# EAGLE design working (EAGLE 6.5.0)
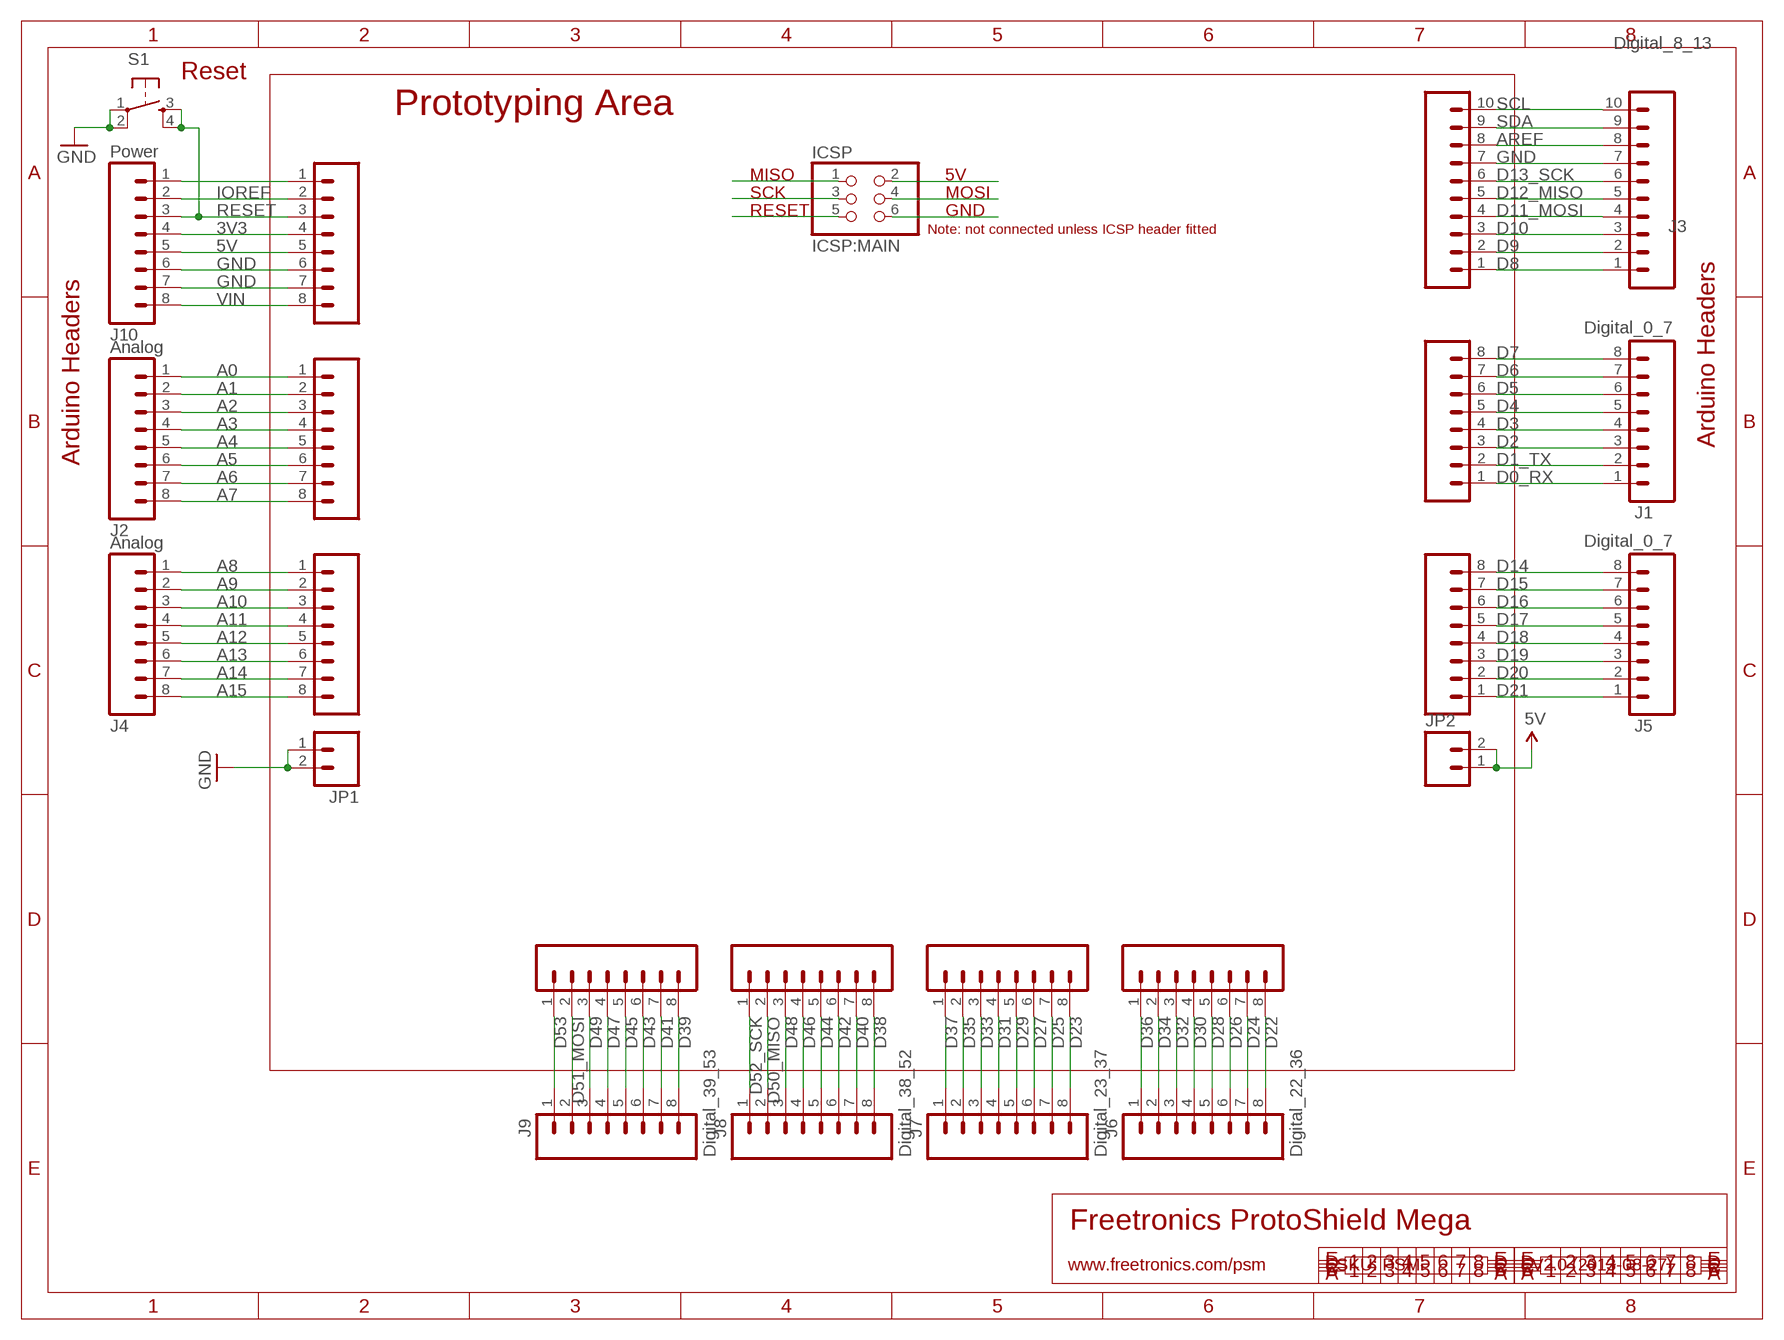
[diagram p0: schematic, sheet 1]

## Parts
ICSP  ICSP:MAIN  PINHD-2X3  [2X03]
J1  Digital_0_7  M08  [1X08]
J2  Analog  M08  [1X08]
J3  Digital_8_13  M100.1  [1X10]
J4  Analog  M08  [1X08]
J5  Digital_0_7  M08  [1X08]
J6  Digital_22_36  M08  [1X08]
J7  Digital_23_37  M08  [1X08]
J8  Digital_38_52  M08  [1X08]
J9  Digital_39_53  M08  [1X08]
J10  Power  M08  [1X08]
JP1  M02PTH  [1X02]
JP2  M02PTH  [1X02]
S1  TAC_SWITCHPTH  [TACTILE-PTH]
SL1  Digital_0_7  M08  [1X08]
SL2  Analog  M08  [1X08]
SL3  Digital_8_13  M100.1  [1X10]
SL4  Analog  M08  [1X08]
SL5  Digital_0_7  M08  [1X08]
SL6  Digital_0_7  M08  [1X08]
SL7  Digital_0_7  M08  [1X08]
SL8  Digital_0_7  M08  [1X08]
SL9  Digital_0_7  M08  [1X08]
SLP  Power  M08  [1X08]

## Nets
3V3: J10.4 SLP.4
5V: J10.5 JP2.1 JP2.2 SLP.5
A0: J2.1 SL2.1
A1: J2.2 SL2.2
A2: J2.3 SL2.3
A3: J2.4 SL2.4
A4: J2.5 SL2.5
A5: J2.6 SL2.6
A6: J2.7 SL2.7
A7: J2.8 SL2.8
A8: J4.1 SL4.1
A9: J4.2 SL4.2
A10: J4.3 SL4.3
A11: J4.4 SL4.4
A12: J4.5 SL4.5
A13: J4.6 SL4.6
A14: J4.7 SL4.7
A15: J4.8 SL4.8
AREF: J3.8 SL3.8
D0_RX: J1.1 SL1.1
D1_TX: J1.2 SL1.2
D2: J1.3 SL1.3
D3: J1.4 SL1.4
D4: J1.5 SL1.5
D5: J1.6 SL1.6
D6: J1.7 SL1.7
D7: J1.8 SL1.8
D8: J3.1 SL3.1
D9: J3.2 SL3.2
D10: J3.3 SL3.3
D11_MOSI: J3.4 SL3.4
D12_MISO: J3.5 SL3.5
D13_SCK: J3.6 SL3.6
D14: J5.8 SL5.8
D15: J5.7 SL5.7
D16: J5.6 SL5.6
D17: J5.5 SL5.5
D18: J5.4 SL5.4
D19: J5.3 SL5.3
D20: J5.2 SL5.2
D21: J5.1 SL5.1
D22: J6.8 SL6.8
D23: J7.8 SL7.8
D24: J6.7 SL6.7
D25: J7.7 SL7.7
D26: J6.6 SL6.6
D27: J7.6 SL7.6
D28: J6.5 SL6.5
D29: J7.5 SL7.5
D30: J6.4 SL6.4
D31: J7.4 SL7.4
D32: J6.3 SL6.3
D33: J7.3 SL7.3
D34: J6.2 SL6.2
D35: J7.2 SL7.2
D36: J6.1 SL6.1
D37: J7.1 SL7.1
D38: J8.8 SL8.8
D39: J9.8 SL9.8
D40: J8.7 SL8.7
D41: J9.7 SL9.7
D42: J8.6 SL8.6
D43: J9.6 SL9.6
D44: J8.5 SL8.5
D45: J9.5 SL9.5
D46: J8.4 SL8.4
D47: J9.4 SL9.4
D48: J8.3 SL8.3
D49: J9.3 SL9.3
D50_MISO: J8.2 SL8.2
D51_MOSI: J9.2 SL9.2
D52_SCK: J8.1 SL8.1
D53: J9.1 SL9.1
GND: J3.7 J10.6 J10.7 JP1.1 JP1.2 S1.1 S1.2 SL3.7 SLP.6 SLP.7
IOREF: J10.2 SLP.2
N$186: ICSP.1
N$187: ICSP.3
N$188: ICSP.5
N$197: ICSP.2
N$198: ICSP.4
N$199: ICSP.6
N$314: J10.1 SLP.1
RESET: J10.3 S1.3 S1.4 SLP.3
SCL: J3.10 SL3.10
SDA: J3.9 SL3.9
VIN: J10.8 SLP.8

## Notes on the sheet
- Reset
- Prototyping Area
- MISO | 5V
- SCK | MOSI
- RESET | GND
- Note: not connected unless ICSP header fitted
- Arduino Headers
- Arduino Headers
- Freetronics ProtoShield Mega
- www.freetronics.com/psm | SKU: PSM | V2.0 (2013-08-27)

## Library data of the parts
ICSP = pinhead:PINHD-2X3: PIN HEADER
J1 J5-J9 SL1 SL5-SL9 = freetronics:M08: Header 8 Standard 8-pin 0.1" header. Use with straight break away headers (SKU : PRT-00116), right angle break away headers (PRT-00553), swiss pins (PRT-00743), machine pins (PRT-00117), and female headers (PRT-00115).
J2 J4 J10 SL2 SL4 SLP = freetronics-master-v1:M08: Header 8 Standard 8-pin 0.1" header. Use with straight break away headers (SKU : PRT-00116), right angle break away headers (PRT-00553), swiss pins (PRT-00743), machine pins (PRT-00117), and female headers (PRT-00115).
J3 SL3 = freetronics-original:M10: Header 10 Standard 10-pin 0.1" header. Use with straight break away headers (SKU : PRT-00116), right angle break away headers (PRT-00553), swiss pins (PRT-00743), machine pins (PRT-00117), and female headers (PRT-00115).
JP1 JP2 = freetronics-master-v1:M02: Header 2 Standard 2-pin 0.1" header. Use with straight break away headers (SKU : PRT-00116), right angle break away headers (PRT-00553), swiss pins (PRT-00743), machine pins (PRT-00117), and female headers (PRT-00115). Molex polarized connector foot print use with SKU : PRT-08233 with associated crimp pins and housings.
S1 = freetronics-master-v1:TAC_SWITCH: Momentary Switch Button commonly used for reset or general input. Spark Fun Electronics SKU : COM-00097

## Board
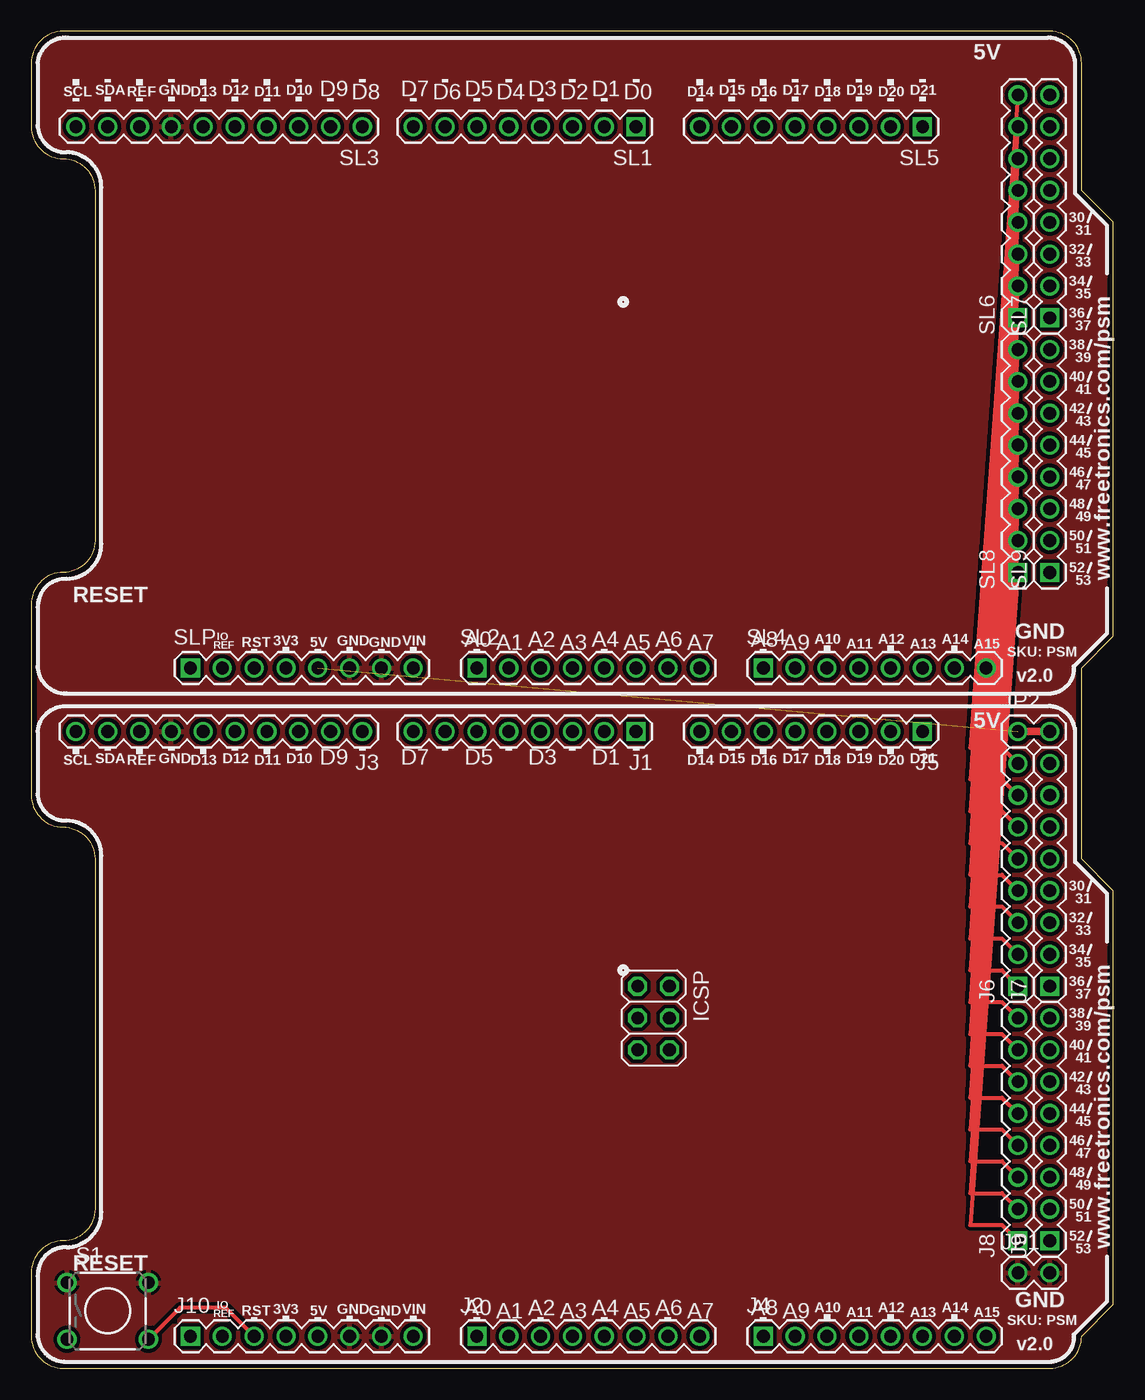
[diagram p1: board, top side]
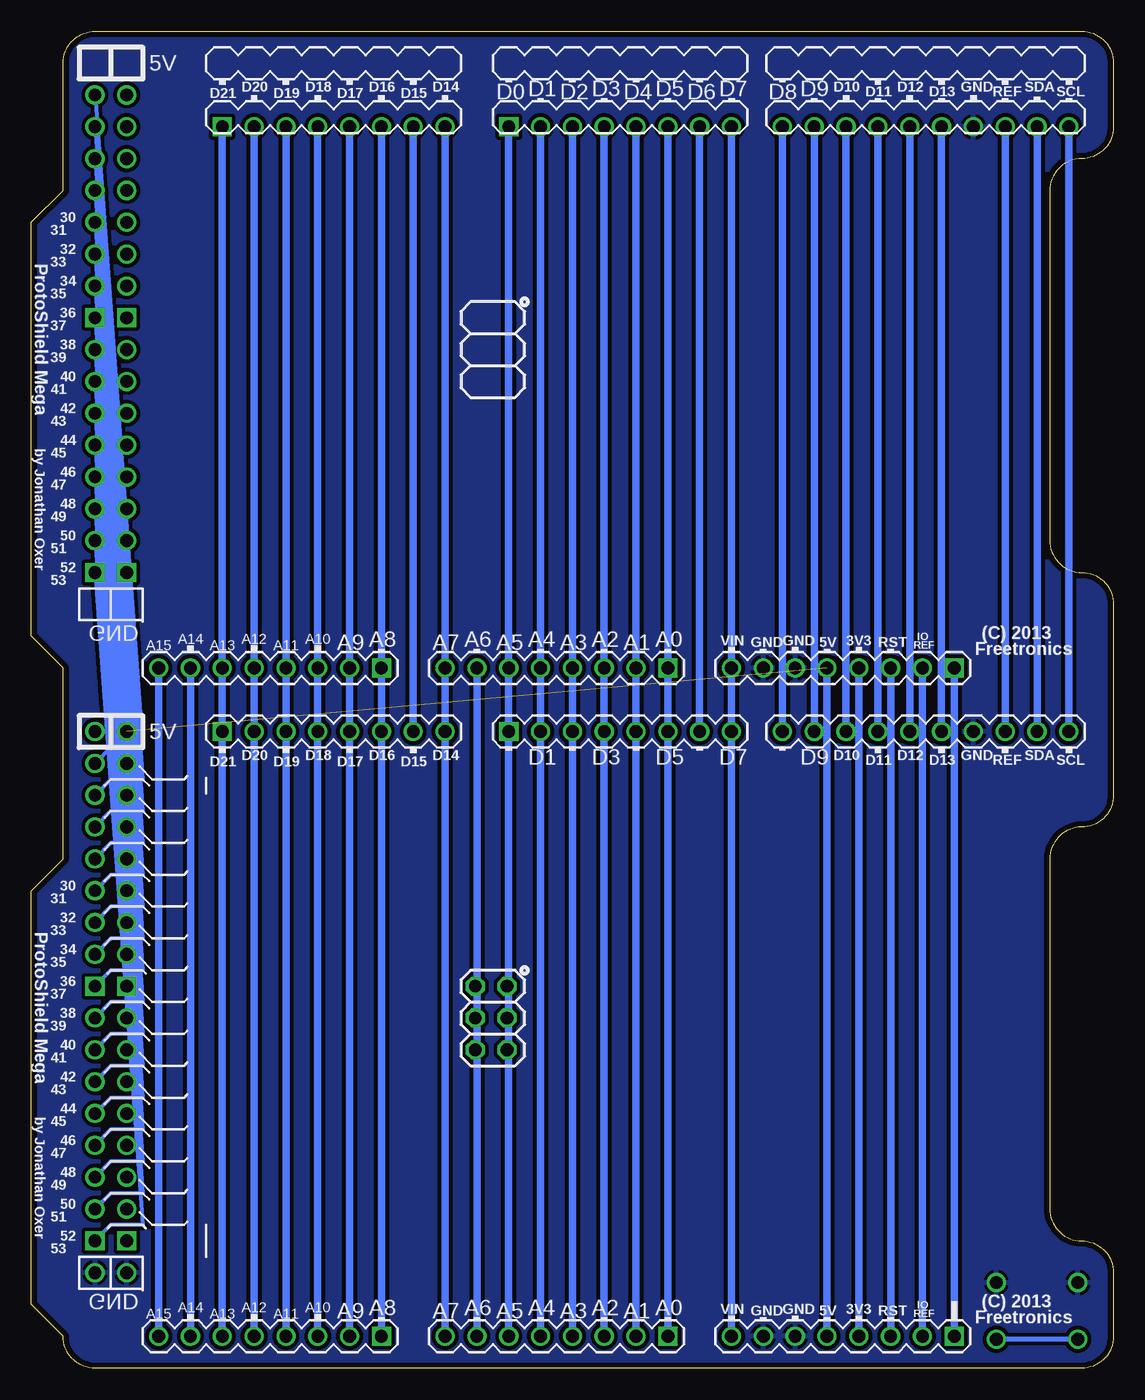
[diagram p2: board, bottom side, seen from below]

Size 86.36 x 106.68 mm. Coordinates in mm from the lower left corner, seen from the top.
Outline: 0,2.54 arc90 2.54,0 81.28,0 arc90 83.82,2.54 86.36,5.08 86.36,38.1 83.82,40.64 83.82,55.88 86.36,58.42 86.36,91.44 83.82,93.98 83.82,104.14 arc90 81.28,106.68 2.54,106.68 arc90 0,104.14 0,99.06 arc90 2.54,96.52 arc-90 5.08,93.98 5.08,66.04 arc-90 2.54,63.5 arc90 0,60.96 0,45.72 arc90 2.54,43.18 arc-90 5.08,40.64 5.08,12.7 arc-90 2.54,10.16 arc90 0,7.62 0,2.54
Copper layers (1*16): Top 0.035mm / dielectric 1.5mm / Bottom 0.035mm
Design rules "default *": minimum track width 10mil, minimum drill 24mil, track to track 12mil, track to pad 12mil, pad to pad 12mil, via to via 12mil, smd to smd 8mil, copper to edge 18mil, drill to drill 8mil, minimum pad ring 10mil, minimum via ring 8mil, stop-mask expansion 4mil, vias tented up to drill 0mil, thermal gap 10mil

### Footprints (pad centres in the part's own frame; a part is rotated, then mirrored left to right if it is on the bottom)
2X03 = drill 1.016 octagon: 1 -2.54,-1.27; 2 -2.54,1.27; 3 0,-1.27; 4 0,1.27; 5 2.54,-1.27; 6 2.54,1.27
1X08 = drill 1.016 square: 1 0,0 | drill 1.016: 2 2.54,0; 3 5.08,0; 4 7.62,0; 5 10.16,0; 6 12.7,0; 7 15.24,0; 8 17.78,0
1X10 = drill 1.016: 1 0,0; 2 2.54,0; 3 5.08,0; 4 7.62,0; 5 10.16,0; 6 12.7,0; 7 15.24,0; 8 17.78,0; 9 20.32,0; 10 22.86,0
1X02 = drill 1.016: 1 0,0; 2 2.54,0
TACTILE-PTH = drill 1.016: 1 -3.251,2.261; 2 3.251,2.261; 3 -3.251,-2.261; 4 3.251,-2.261

### Placement (x,y rotation side)
ICSP  49.66,27.94 270 top
J1  48.26,50.8 180 top
J2  35.56,2.54 0 top
J3  26.42,50.8 180 top
J4  58.42,2.54 0 top
J5  71.12,50.8 180 top
J6  78.74,30.48 90 top
J7  81.28,30.48 90 top
J8  78.74,10.16 90 top
J9  81.28,10.16 90 top
J10  12.7,2.54 0 top
JP1  78.74,7.62 0 top
JP2  78.74,50.8 0 top
S1  6.1,4.57 0 top
SL1  48.26,99.06 180 top
SL2  35.56,55.88 0 top
SL3  26.42,99.06 180 top
SL4  58.42,55.88 0 top
SL5  71.12,99.06 180 top
SL6  78.74,83.82 90 top
SL7  81.28,83.82 90 top
SL8  78.74,63.5 90 top
SL9  81.28,63.5 90 top
SLP  12.7,55.88 0 top

### Tracks (layer width: path | path; a pad name or v marks a point on that pad's centre or on a via)
3V3
  Bottom 0.61: J10.4 SLP.4
5V  (1 unrouted)
  Top 0.61: JP2.1 JP2.2
  Bottom 0.61: J10.5 SLP.5
A0
  Bottom 0.61: J2.1 SL2.1
A1
  Bottom 0.61: J2.2 SL2.2
A2
  Bottom 0.61: J2.3 SL2.3
A3
  Bottom 0.61: J2.4 SL2.4
A4
  Bottom 0.61: J2.5 SL2.5
A5
  Bottom 0.61: J2.6 SL2.6
A6
  Bottom 0.61: J2.7 SL2.7
A7
  Bottom 0.61: J2.8 SL2.8
A8
  Bottom 0.61: J4.1 SL4.1
A9
  Bottom 0.61: J4.2 SL4.2
A10
  Bottom 0.61: J4.3 SL4.3
A11
  Bottom 0.61: J4.4 SL4.4
A12
  Bottom 0.61: J4.5 SL4.5
A13
  Bottom 0.61: J4.6 SL4.6
A14
  Bottom 0.61: J4.7 SL4.7
A15
  Bottom 0.61: J4.8 SL4.8
AREF
  Bottom 0.61: SL3.8 J3.8
D0_RX
  Bottom 0.61: SL1.1 J1.1
D1_TX
  Bottom 0.61: SL1.2 J1.2
D2
  Bottom 0.61: SL1.3 J1.3
D3
  Bottom 0.61: SL1.4 J1.4
D4
  Bottom 0.61: SL1.5 J1.5
D5
  Bottom 0.61: SL1.6 J1.6
D6
  Bottom 0.61: SL1.7 J1.7
D7
  Bottom 0.61: SL1.8 J1.8
D8
  Bottom 0.61: SL3.1 J3.1
D9
  Bottom 0.61: SL3.2 J3.2
D10
  Bottom 0.61: SL3.3 J3.3
D11_MOSI
  Bottom 0.61: SL3.4 J3.4
D12_MISO
  Bottom 0.61: SL3.5 J3.5
D13_SCK
  Bottom 0.61: SL3.6 J3.6
D14
  Bottom 0.61: SL5.8 J5.8
D15
  Bottom 0.61: SL5.7 J5.7
D16
  Bottom 0.61: SL5.6 J5.6
D17
  Bottom 0.61: SL5.5 J5.5
D18
  Bottom 0.61: SL5.4 J5.4
D19
  Bottom 0.61: SL5.3 J5.3
D20
  Bottom 0.61: SL5.2 J5.2
D21
  Bottom 0.61: SL5.1 J5.1
D22
  Top 0.305: J6.8 77.47,49.53 74.93,49.53 SL6.8
D23
  Bottom 0.305: J7.8 80.01,49.53 77.47,49.53 SL7.8
D24
  Top 0.305: J6.7 77.47,46.99 74.93,46.99 SL6.7
D25
  Bottom 0.305: J7.7 80.01,46.99 77.47,46.99 SL7.7
D26
  Top 0.305: J6.6 77.47,44.45 74.93,44.45 SL6.6
D27
  Bottom 0.305: J7.6 80.01,44.45 77.47,44.45 SL7.6
D28
  Top 0.305: J6.5 77.47,41.91 74.93,41.91 SL6.5
D29
  Bottom 0.305: J7.5 80.01,41.91 77.47,41.91 SL7.5
D30
  Top 0.305: J6.4 77.47,39.37 74.93,39.37 SL6.4
D31
  Bottom 0.305: J7.4 80.01,39.37 77.47,39.37 SL7.4
D32
  Top 0.305: J6.3 77.47,36.83 74.93,36.83 SL6.3
D33
  Bottom 0.305: J7.3 80.01,36.83 77.47,36.83 SL7.3
D34
  Top 0.305: J6.2 77.47,34.29 74.93,34.29 SL6.2
D35
  Bottom 0.305: J7.2 80.01,34.29 77.47,34.29 SL7.2
D36
  Top 0.305: J6.1 77.47,31.75 74.93,31.75 SL6.1
D37
  Bottom 0.305: J7.1 80.01,31.75 77.47,31.75 SL7.1
D38
  Top 0.305: J8.8 77.47,29.21 74.93,29.21 SL8.8
D39
  Bottom 0.305: J9.8 80.01,29.21 77.47,29.21 SL9.8
D40
  Top 0.305: J8.7 77.47,26.67 74.93,26.67 SL8.7
D41
  Bottom 0.305: J9.7 80.01,26.67 77.47,26.67 SL9.7
D42
  Top 0.305: J8.6 77.47,24.13 74.93,24.13 SL8.6
D43
  Bottom 0.305: J9.6 80.01,24.13 77.47,24.13 SL9.6
D44
  Top 0.305: J8.5 77.47,21.59 74.93,21.59 SL8.5
D45
  Bottom 0.305: J9.5 80.01,21.59 77.47,21.59 SL9.5
D46
  Top 0.305: J8.4 77.47,19.05 74.93,19.05 SL8.4
D47
  Bottom 0.305: J9.4 80.01,19.05 77.47,19.05 SL9.4
D48
  Top 0.305: J8.3 77.47,16.51 74.93,16.51 SL8.3
D49
  Bottom 0.305: J9.3 80.01,16.51 77.47,16.51 SL9.3
D50_MISO
  Top 0.305: J8.2 77.47,13.97 74.93,13.97 SL8.2
D51_MOSI
  Bottom 0.305: J9.2 80.01,13.97 77.47,13.97 SL9.2
D52_SCK
  Top 0.305: J8.1 77.47,11.43 74.93,11.43 SL8.1
D53
  Bottom 0.305: J9.1 80.01,11.43 77.47,11.43 SL9.1
GND
  pour Bottom: 0,104.14 arc-74 2.54,106.68 81.28,106.68 arc-74 83.82,104.14 83.82,93.98 86.36,91.44 86.36,58.42 83.82,55.88 83.82,40.64 86.36,38.1 86.36,5.08 83.82,2.54 arc-74 81.28,0 1.27,0 arc-74 0,2.54 0,7.62 arc-90 2.54,10.16 arc90 5.08,12.7 5.08,40.64 arc90 2.54,43.18 arc-90 0,45.72
  pour Top: 0,104.14 arc-74 2.54,106.68 81.28,106.68 arc-74 83.82,104.14 83.82,93.98 86.36,91.44 86.36,58.42 83.82,55.88 83.82,40.64 86.36,38.1 86.36,5.08 83.82,2.54 arc-74 81.28,0 1.27,0 arc-74 0,2.54 0,7.62 arc-90 2.54,10.16 arc90 5.08,12.7 5.08,40.64 arc90 2.54,43.18 arc-90 0,45.72
IOREF
  Bottom 0.61: SLP.2 J10.2
N$314
  Bottom 0.61: SLP.1 J10.1
RESET
  Top 0.305: J10.3 15.49,4.83 11.86,4.83 S1.4
  Bottom 0.406: S1.3 S1.4
  Bottom 0.61: J10.3 SLP.3
SCL
  Bottom 0.61: J3.10 SL3.10
SDA
  Bottom 0.61: J3.9 SL3.9
VIN
  Bottom 0.61: SLP.8 J10.8

### Text on the board
tPlace: 5V | SDA | GND | D12 | D10 | D15 | D17 | D19 | D21 | SCL | REF | D13 | D11 | D9 | D8 | D7 | D6 | D5 | D4 | D3 | D2 | D1 | D0 | D14 | D16 | D18 | D20 | 30 | 31 | 32 | 33 | 34 | 35 | 36 | 37 | 38 | 39 | 40 | 41 | 42 | 43 | 44 | 45 | 46 | 47 | 48 | 49 | 50 | 51 | 52 | www.freetronics.com/psm | 53 | RESET | IO | RST | 3V3 | 5V | GND | GND | VIN | A0 | A2 | A4 | A6 | A8 | A10 | A12 | A14 | GND | REF | A1 | A3 | A5 | A7 | A9 | A11 | A13 | A15 | SKU: PSM | v2.0 | 5V | SCL | SDA | REF | GND | D13 | D12 | D11 | D10 | D9 | D7 | D5 | D3 | D1 | D14 | D15 | D16 | D17 | D18 | D19 | D20 | D21 | 30 | 31 | 32 | 33 | 34 | 35 | 36 | 37 | 38 | 39 | 40 | 41 | 42 | 43 | 44 | 45 | 46 | 47 | 48 | 49 | 50 | 51 | 52 | www.freetronics.com/psm | 53 | RESET | IO | GND | REF | RST | 3V3 | 5V | GND | GND | VIN | A0 | A1 | A2 | A3 | A4 | A5 | A6 | A7 | A8 | A9 | A10 | A11 | A12 | A13 | A14 | A15 | SKU: PSM | v2.0
bPlace: 5V | SDA | GND | D12 | D10 | D14 | D16 | D18 | D20 | SCL | REF | D13 | D11 | D9 | D8 | D7 | D6 | D5 | D4 | D3 | D2 | D1 | D0 | D15 | D17 | D19 | D21 | 30 | 31 | 32 | 33 | ProtoShield Mega | 34 | 35 | 36 | 37 | 38 | 39 | 40 | 41 | 42 | 43 | 44 | 45 | by Jonathan Oxer | 46 | 47 | 48 | 49 | 50 | 51 | 52 | 53 | GND | (C) 2013 | IO | RST | 3V3 | 5V | GND | GND | VIN | A0 | A2 | A4 | A6 | A8 | A10 | A12 | A14 | Freetronics | REF | A1 | A3 | A5 | A7 | A9 | A11 | A13 | A15 | 5V | SDA | GND | D12 | D10 | D14 | D16 | D18 | D20 | SCL | REF | D13 | D11 | D9 | D7 | D5 | D3 | D1 | D15 | D17 | D19 | D21 | 30 | 31 | 32 | 33 | ProtoShield Mega | 34 | 35 | 36 | 37 | 38 | 39 | 40 | 41 | 42 | 43 | 44 | by Jonathan Oxer | 45 | 46 | 47 | 48 | 49 | 50 | 51 | 52 | 53 | GND | (C) 2013 | IO | Freetronics | REF | RST | 3V3 | 5V | GND | GND | VIN | A0 | A1 | A2 | A3 | A4 | A5 | A6 | A7 | A8 | A9 | A10 | A11 | A12 | A13 | A14 | A15